# Altium schematic sheet [01] - COVER PAGE.SchDoc
size A4; DocumentNumber: 1; SheetNumber: 1; SheetTotal: 9
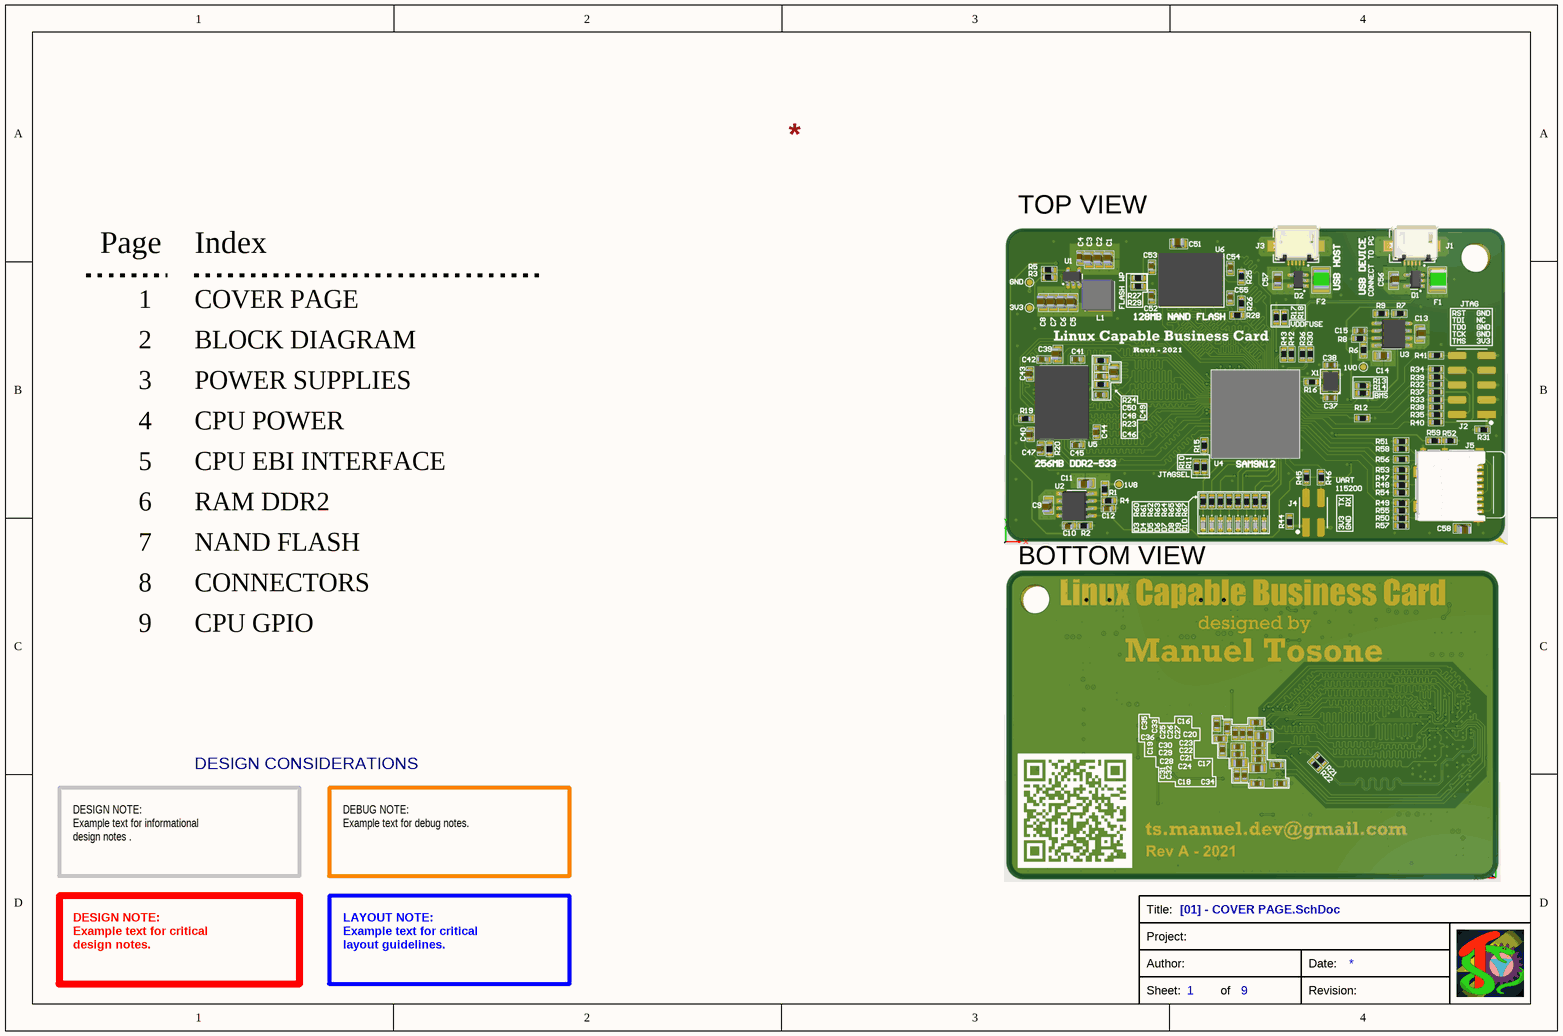
[diagram p0: [01] - COVER PAGE.SchDoc]

## Notes on the sheet
- TOP VIEW
- Page
- 1
- Index
- COVER PAGE
- 2
- BLOCK DIAGRAM
- 3
- 4
- POWER SUPPLIES
- CPU POWER
- 5
- 6
- CPU EBI INTERFACE
- RAM DDR2
- 7
- NAND FLASH
- BOTTOM VIEW
- 8
- 9
- CONNECTORS
- CPU GPIO
- DESIGN CONSIDERATIONS
- DESIGN NOTE:
  Example text for informational
  design notes .
- DEBUG NOTE:
  Example text for debug notes.
- DESIGN NOTE:
  Example text for critical
  design notes.
- LAYOUT NOTE:
  Example text for critical
  layout guidelines.
- Title:
- Project:
- Sheet:
- Author:
- of
- Revision:
- Date: